# EAGLE design dribbler (EAGLE 9.6.2)
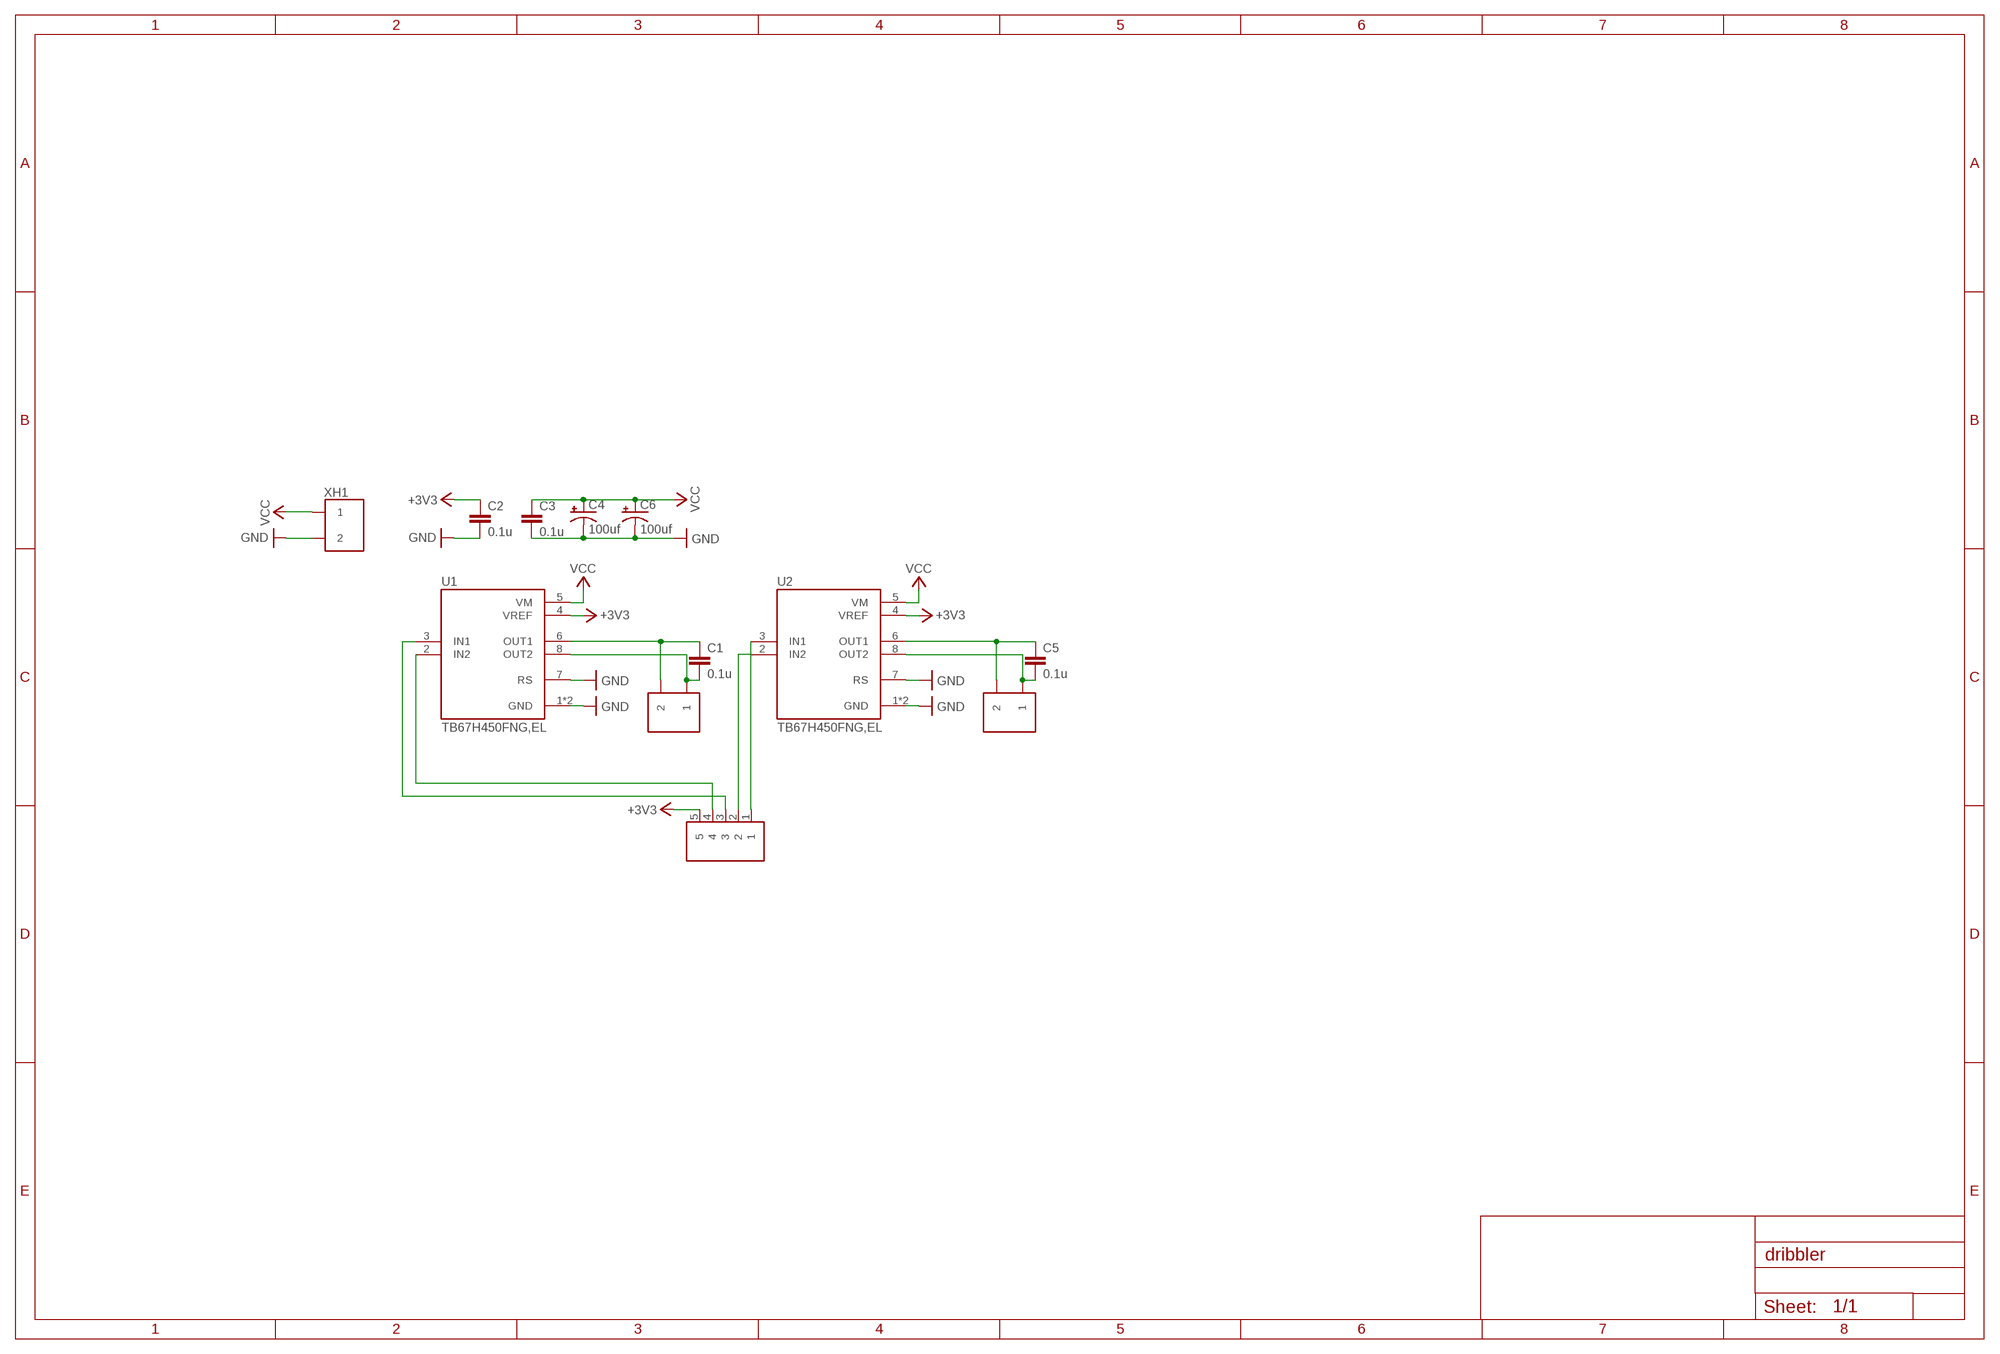
[diagram p0: schematic, sheet 1]

## Parts
C1  0.1u  C-EUC0603  [C0603]
C2  0.1u  C-EUC0603  [C0603]
C3  0.1u  C-EUC0603  [C0603]
C4  100uf  MH5  [MH5]
C5  0.1u  C-EUC0603  [C0603]
C6  100uf  MH5  [MH5]
U1  TB67H450FNG,EL  [SOIC127P599X175-9N]
U2  TB67H450FNG,EL  [SOIC127P599X175-9N]
U$1  S2B  [S2B]
U$2  S5B  [S5B]
U$3  S2B  [S2B]
XH1  S2B  [S2B]

## Nets
+3V3: C2.1 U1.4(VREF) U2.4(VREF) U$2.5
GND: C2.2 C3.2 C4.- C6.- U1.1(GND) U1.7(RS) U1.9(GND) U2.1(GND) U2.7(RS) U2.9(GND) XH1.2
N$1: C5.1 U2.6(OUT1) U$3.2
N$2: C1.2 U1.8(OUT2) U$1.1
N$3: U1.3(IN1) U$2.3
N$4: U1.2(IN2) U$2.4
N$5: C5.2 U2.8(OUT2) U$3.1
N$6: U2.2(IN2) U$2.2
N$7: U2.3(IN1) U$2.1
N$9: C1.1 U1.6(OUT1) U$1.2
VCC: C3.1 C4.+ C6.+ U1.5(VM) U2.5(VM) XH1.1

## Library data of the parts
C1-C3 C5 = rcl:C-EU: CAPACITOR, European symbol; SPICEPREFIX: C
C4 C6 = capacitor:MH5
U1 U2 = TB67H450FNG_EL:TB67H450FNG,EL: Check availability <https://pricing.snapeda.com/parts/TB67H450FNG%2CEL/Toshiba%20Semiconductor%20and%20Storage/view-part?ref=eda>; AVAILABILITY: In Stock; DESCRIPTION: - Motor Driver - - 8-HSOP; MF: Toshiba Semiconductor and Storage; MP: TB67H450FNG,EL; PACKAGE: SOIC-8 Toshiba Semiconductor and Storage; PRICE: None; PURCHASE-URL: https://pricing.snapeda.com/search/part/TB67H450FNG,EL/?ref=eda
U$1 U$3 XH1 = XH:S2B
U$2 = XH:S5B

## Board
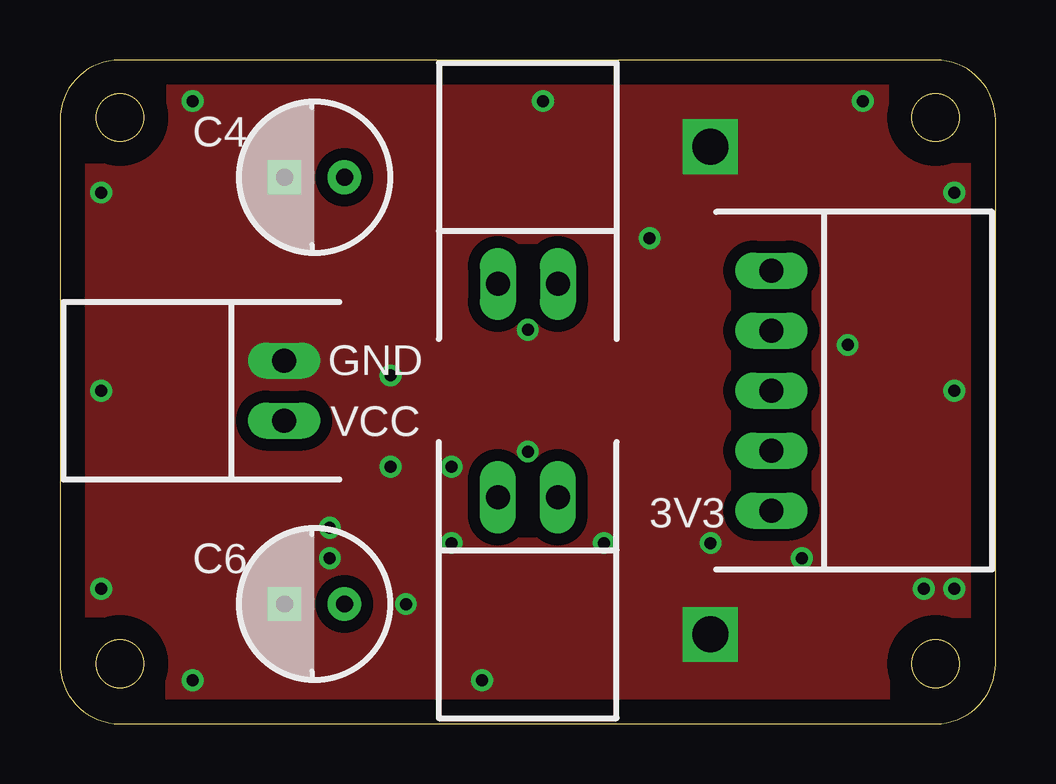
[diagram p1: board, top side]
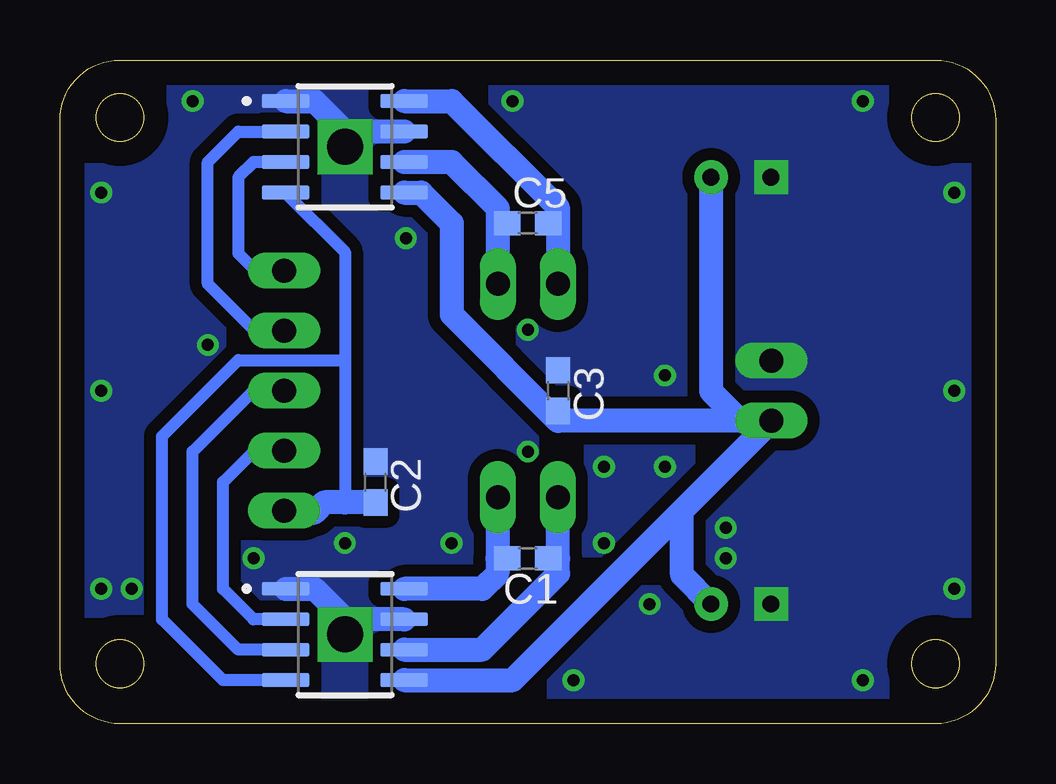
[diagram p2: board, bottom side, seen from below]

Size 39 x 27.66 mm. Coordinates in mm from the lower left corner, seen from the top.
Outline: 0,2.5 arc90 2.5,0
Outline: 36.5,0 arc90 39,2.5
Outline: 39,25.16 arc90 36.5,27.66
Outline: 2.5,27.66 arc90 0,25.16
Outline: 0,25.16 0,2.5
Outline: 0,2.5 arc90 2.5,0
Outline: 2.5,0 36.5,0
Outline: 36.5,0 arc90 39,2.5
Outline: 39,2.5 39,25.16
Outline: 39,25.16 arc90 36.5,27.66
Outline: 36.5,27.66 2.5,27.66
Outline: 2.5,27.66 arc90 0,25.16
Outline: circle at 2.5,2.5 radius 1
Outline: circle at 2.5,25.26 radius 1
Outline: circle at 36.5,2.5 radius 1
Outline: circle at 36.5,25.26 radius 1
Copper layers (1*16): Top 0.035mm / dielectric 1.5mm / Bottom 0.035mm
Design rules "default": minimum track width 6mil, minimum drill 0.35mm, track to track 6mil, track to pad 6mil, pad to pad 6mil, via to via 6mil, smd to smd 6mil, copper to edge 40mil, drill to drill 6mil, minimum pad ring 10mil, minimum via ring 8mil, stop-mask expansion 4mil, vias tented up to drill 0mil, thermal gap 10mil

### Footprints (pad centres in the part's own frame; a part is rotated, then mirrored left to right if it is on the bottom)
C0603 = smd 1.1 x 1: 1 -0.85,0; 2 0.85,0
MH5 = drill 0.7 pad 1.4: + 1.25,0 | drill 0.7 pad 1.4 square: - -1.25,0
SOIC127P599X175-9N = smd 1.97 x 0.58: 1 -2.47,1.905; 2 -2.47,0.635; 3 -2.47,-0.635; 4 -2.47,-1.905; 5 2.47,-1.905; 6 2.47,-0.635; 7 2.47,0.635; 8 2.47,1.905 | drill 1.5 pad 2.285 square: 9 0,0
S2B = drill 1 long: 1 0,1.25; 2 0,-1.25
S5B = drill 1 long: 1 0,5; 2 0,2.5; 3 0,0; 4 0,-2.5; 5 0,-5

### Placement (x,y rotation side)
C1  19.5,6.89 180 bottom
C2  25.85,10.07 90 bottom
C3  18.23,13.88 90 bottom
C4  10.61,22.77 0 top
C5  19.5,20.86 0 bottom
C6  10.61,4.99 0 top
U1  27.12,3.72 0 bottom
U2  27.12,24.04 0 bottom
U$1  19.5,9.43 270 top
U$2  29.66,13.88 0 top
U$3  19.5,18.32 90 top
XH1  9.34,13.88 180 top

### Tracks (layer width: path | path; a pad name or v marks a point on that pad's centre or on a via)
+3V3
  Bottom 0.5: U2.4 27.12,19.66 27.12,15.15 | 27.12,15.15 27.12,9.22 | U1.4 32.2,1.81 34.74,4.35 34.74,11.97 31.56,15.15 27.12,15.15
  Bottom 1: C2.1 27.12,9.22 27.97,9.22 28.39,8.8 29.58,8.8 U$2.5
GND  (via drill 0.5)
  Bottom 1: U2.7 26.48,24.67 U2.9 27.12,24.67 28.39,25.94 U2.1 | U1.7 26.48,4.35 U1.9 27.12,4.35 28.39,5.62 U1.1
  other vias: 5.53,25.94 1.72,22.13 1.72,5.62 5.53,1.81 14.42,4.99 17.59,1.81 19.5,16.42 16.32,7.53 30.93,6.89 24.58,20.23 27.12,7.53 20.14,25.94 22.68,7.53 33.47,25.94 37.28,22.13 37.28,5.62 36.01,5.62 37.28,13.88 19.5,11.34 13.79,14.51 11.24,8.16 11.24,6.89 1.72,13.88 32.84,15.78 16.32,10.7 13.79,10.7
  pour Top (isolate 0.5, no thermals): -2.09,30.39 42.36,30.39 42.36,-2.63 -2.09,-2.63
  pour Bottom (isolate 0.5, no thermals): -3.36,31.66 42.36,31.66 42.36,-3.9 -3.36,-3.9
N$1
  Bottom 1: U$3.2 20.75,20.86 | 20.75,20.86 20.75,21.48 22.68,23.4 U2.6 | C5.1 20.75,20.86
N$2
  Bottom 1: U$1.1 20.77,9.41 20.77,6.89 | 20.77,6.89 20.77,6.26 21.41,5.62 U1.8 | C1.2 20.77,6.89
N$3
  Bottom 0.5: U1.3 31.56,3.08 33.47,4.99 33.47,11.34 30.93,13.88 U$2.3
N$4
  Bottom 0.5: U1.2 30.93,4.35 32.2,5.62 32.2,10.07 30.89,11.38 U$2.4
N$5
  Bottom 1: U2.8 22.68,25.94 18.25,21.52 18.25,20.86 | 18.25,20.86 U$3.1 | C5.2 18.25,20.86
N$6
  Bottom 0.5: U$2.2 30.89,16.38 32.84,18.32 32.84,23.4 31.56,24.67 U2.2
N$7
  Bottom 0.5: U2.3 30.93,23.4 31.56,22.77 31.56,19.59 30.85,18.88 U$2.1
N$9
  Bottom 1: U1.6 21.41,3.08 18.23,6.26 18.23,6.89 | 18.23,6.89 18.23,9.41 U$1.2 | C1.1 18.23,6.89
VCC
  Bottom 1: U1.5 20.14,1.81 | 20.14,1.81 20.11,1.81 | U2.5 23.95,22.13 22.68,20.86 22.68,17.05 18.23,12.61 | 20.14,1.81 13.07,8.88 | C3.1 18.23,12.61 | C6.+ 13.07,6.2 13.07,8.88 | C4.+ 11.86,13.86 10.61,12.61 9.36,12.61 | 9.36,12.61 XH1.1 18.21,12.63 18.23,12.61 | 13.07,8.88 9.36,12.59 9.36,12.61

### Text on the board
tPlace: GND | VCC | 3V3